# Altium schematic sheet Reset Supervisor.SchDoc
size A4
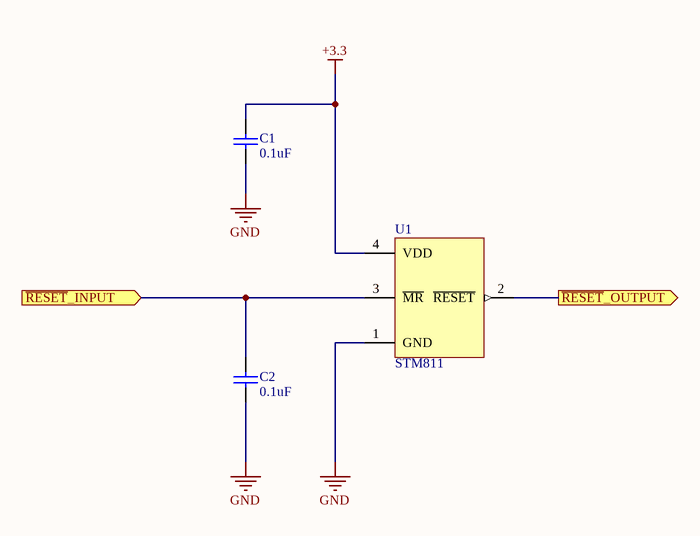
[diagram p0: Reset Supervisor.SchDoc]

## Parts
C1  value 0.1uF  [C0603]  (hidden comment: Cap)
C2  value 0.1uF  [C0603]  (hidden comment: Cap)
U1  STM811  [STM811]

## Ports
~{RESET}_INPUT (in), ~{RESET}_OUTPUT (out)

## Nets
+3.3: C1.1 U1.4(VDD)
GND: C1.2 C2.2 U1.1(GND)
~{RESET}_INPUT: C2.1 U1.3(~{MR}) ; port ~{RESET}_INPUT
~{RESET}_OUTPUT: U1.2(~{RESET}) ; port ~{RESET}_OUTPUT

## Library data of the parts
C1 C2 = Cap: Capacitor; farnell: 1759122
U1 = STM811: STMICROELECTRONICS - STM811TW16F - MPU LOW RESET 3.08V, SOT-143-4, 811; farnell: 8690537